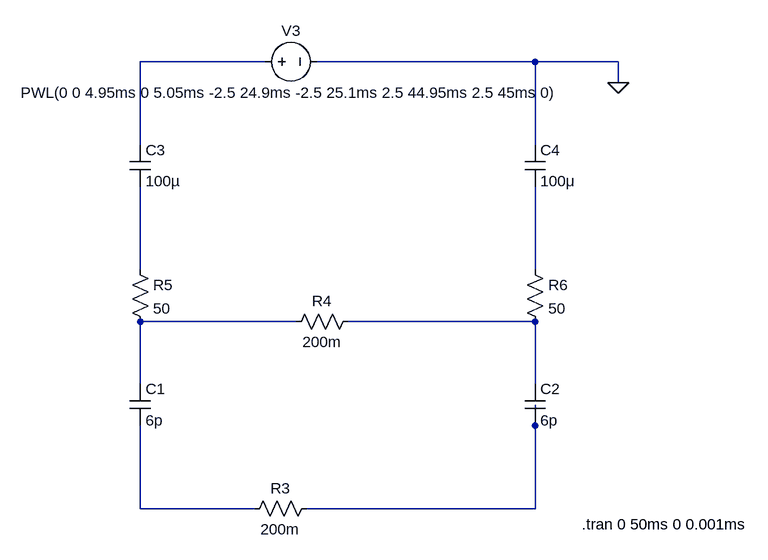
[diagram p0: schematic 電圧刺激等価回路_2compartment_tmp2過渡状態.asc]
電圧刺激等価回路_2compartment_tmp2過渡状態.asc, the LTspice schematic file:
Version 4
SHEET 1 1116 680
WIRE 320 -368 128 -368
WIRE 736 -368 400 -368
WIRE 864 -368 736 -368
WIRE 864 -336 864 -368
WIRE 128 -240 128 -368
WIRE 736 -240 736 -368
WIRE 128 -48 128 -176
WIRE 736 -48 736 -176
WIRE 368 32 128 32
WIRE 736 32 448 32
WIRE 128 128 128 32
WIRE 736 128 736 32
WIRE 736 192 736 160
WIRE 128 320 128 192
WIRE 304 320 128 320
WIRE 736 320 736 192
WIRE 736 320 384 320
FLAG 864 -336 0
SYMBOL voltage 304 -368 R270
WINDOW 0 32 56 VTop 2
WINDOW 3 -32 56 VBottom 2
WINDOW 123 0 0 Left 0
WINDOW 39 0 0 Left 0
SYMATTR InstName V3
SYMATTR Value PWL(0 0 4.95ms 0 5.05ms -2.5 24.9ms -2.5 25.1ms 2.5 44.95ms 2.5 45ms 0)
SYMBOL res 400 304 R90
WINDOW 0 0 56 VBottom 2
WINDOW 3 32 56 VTop 2
SYMATTR InstName R3
SYMATTR Value 200m
SYMBOL res 112 -64 R0
SYMATTR InstName R5
SYMATTR Value 50
SYMBOL res 720 -64 R0
SYMATTR InstName R6
SYMATTR Value 50
SYMBOL cap 112 128 R0
SYMATTR InstName C1
SYMATTR Value 6p
SYMBOL cap 720 128 R0
SYMATTR InstName C2
SYMATTR Value 6p
SYMBOL cap 112 -240 R0
SYMATTR InstName C3
SYMATTR Value 100µ
SYMBOL cap 720 -240 R0
SYMATTR InstName C4
SYMATTR Value 100μ
SYMBOL res 464 16 R90
WINDOW 0 0 56 VBottom 2
WINDOW 3 32 56 VTop 2
SYMATTR InstName R4
SYMATTR Value 200m
TEXT 808 344 Left 2 !.tran 0 50ms 0 0.001ms

The netlist it stands for:
* 電圧刺激等価回路_2compartment_tmp2過渡状態.asc
V3 N001 0 PWL(0 0 4.95ms 0 5.05ms -2.5 24.9ms -2.5 25.1ms 2.5 44.95ms 2.5 45ms 0)
R3 N006 N007 200m
R5 N002 N004 50
R6 N003 N005 50
C1 N004 N007 6p
C2 N005 N006 6p
C3 N001 N002 100µ
C4 0 N003 100μ
R4 N005 N004 200m
.tran 0 50ms 0 0.001ms
.backanno
.end